# EAGLE design MOD-LCD3310 (EAGLE 6.4)
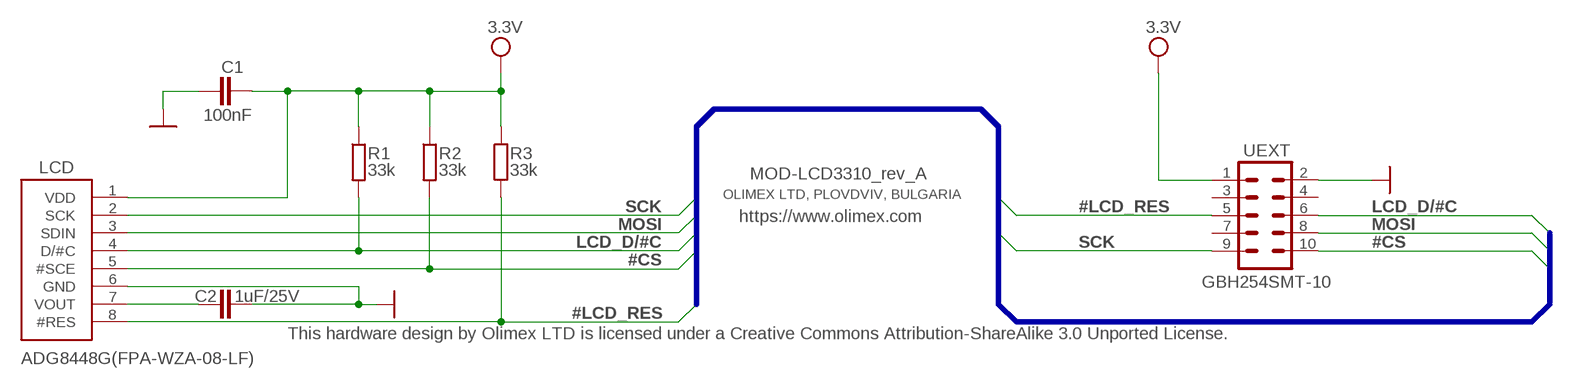
[diagram p0: schematic, sheet 1]

## Parts
C1  100nF  C-EUC0603_DWS  [C0603_DWS]
C2  1uF/25V  C-EUC0805_5MIL_DWS  [C0805_5MIL_DWS]
LCD  ADG8448G(FPA-WZA-08-LF)  NOKIA_3310_LCD-ADG8448G(FPA-WZA-08-LF)  [NOKIA_3310_LCD_CON8_EXACTLY_BOT]
R1  33k  R-EU_R0603_5MIL_DWS  [R0603_5MIL_DWS]
R2  33k  R-EU_R0603_5MIL_DWS  [R0603_5MIL_DWS]
R3  33k  R-EU_R0603_5MIL_DWS  [R0603_5MIL_DWS]
UEXT  GBH254SMT-10  ML10MD  [ML10_S]

## Nets
#CS: LCD.5(#SCE) R2.2 UEXT.10
#LCD_RES: LCD.8(#RES) R3.2 UEXT.5
GND: C1.2 C2.1 LCD.6(GND) UEXT.2
LCD_D/#C: LCD.4(D/#C) R1.2 UEXT.6
LCD_VOUT: C2.2 LCD.7(VOUT)
MOSI: LCD.3(SDIN) UEXT.8
SCK: LCD.2(SCK) UEXT.9
VCC: C1.1 LCD.1(VDD) R1.1 R2.1 R3.1 UEXT.1 ; supply symbol labelled 3.3V
Unconnected: UEXT.3 UEXT.4 UEXT.7

## Buses
SCK,MOSI,#CS,LCD_D/#C,#LCD_RES

## Notes on the sheet
- MOD-LCD3310_rev_A
- OLIMEX LTD, PLOVDVIV, BULGARIA
- https://www.olimex.com
- This hardware design by Olimex LTD is licensed under a Creative Commons Attribution-ShareAlike 3.0 Unported License.

## Library data of the parts
C1 C2 = rcl:C-EU: CAPACITOR, European symbol
LCD = OLIMEX_IC:NOKIA_3310_LCD
R1-R3 = rcl:R-EU_: RESISTOR, European symbol
UEXT = con-harting-ml:ML10: HARTING

## Board
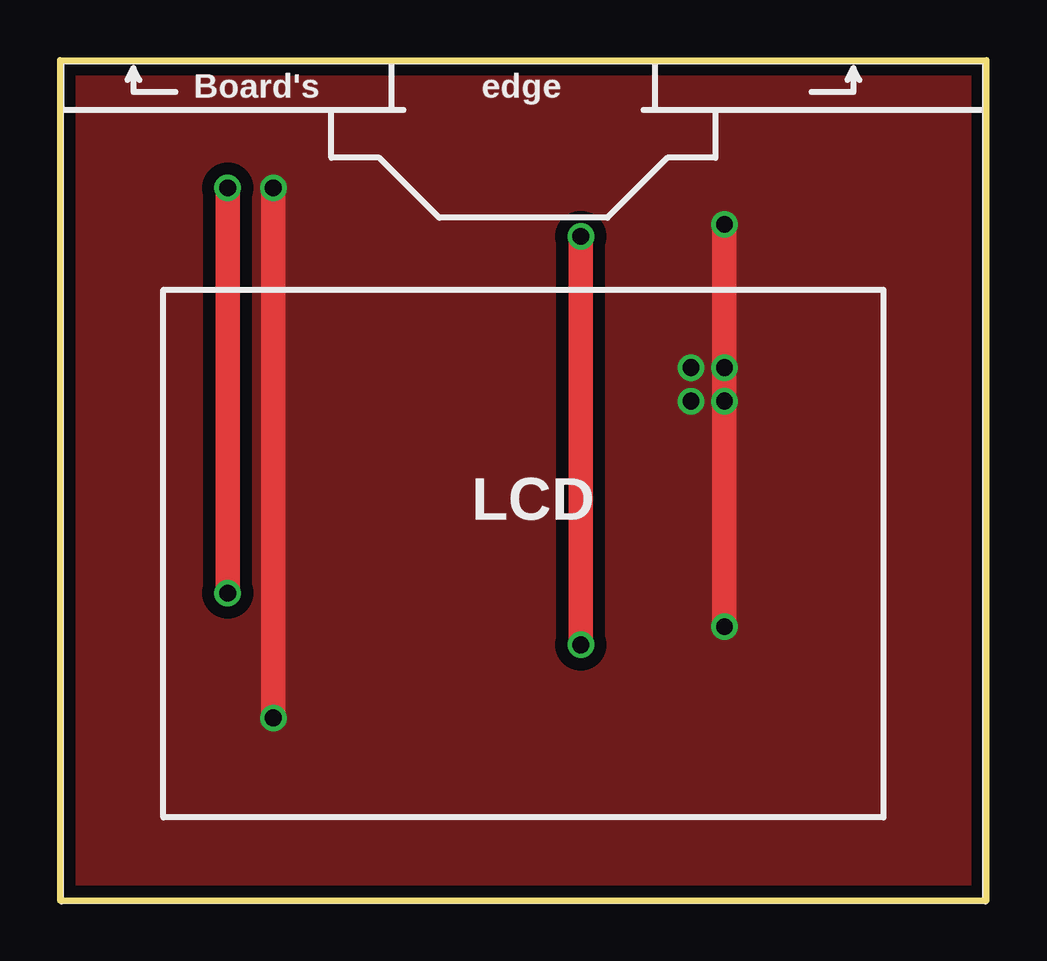
[diagram p1: board, top side]
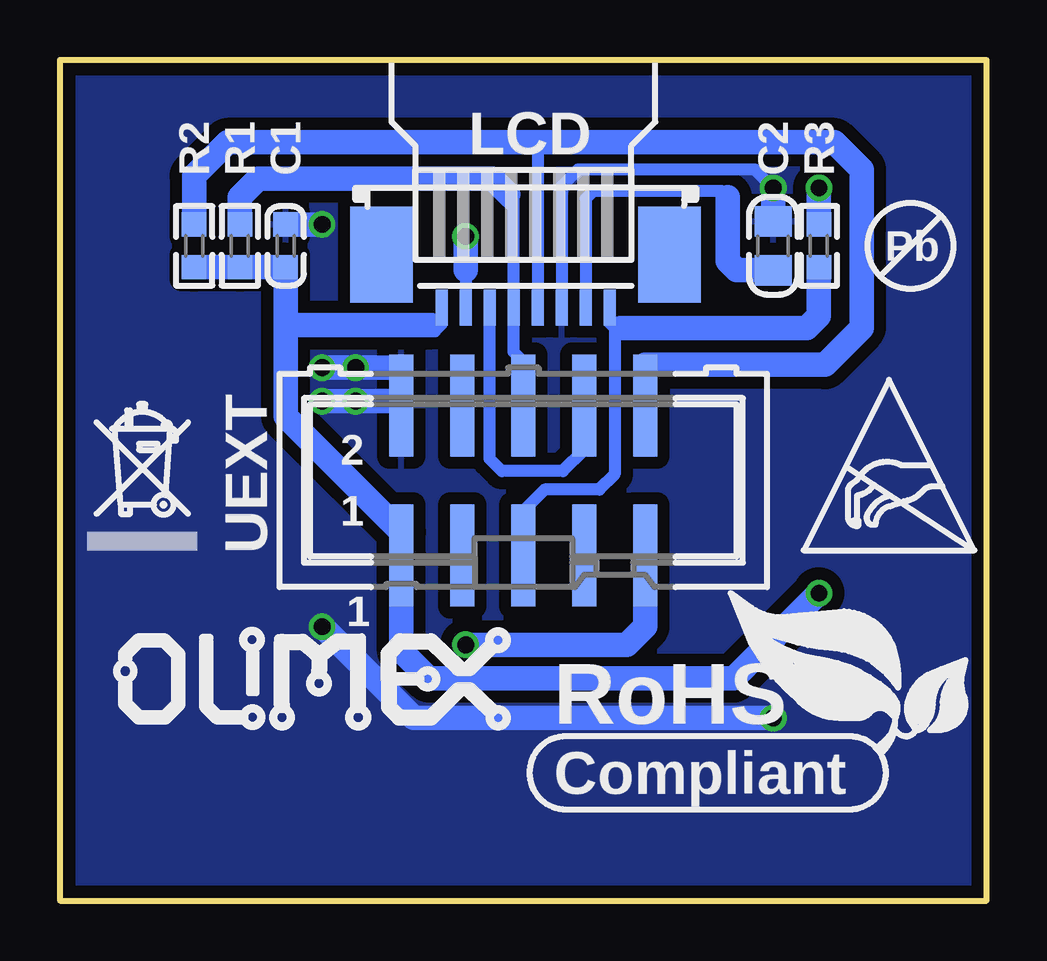
[diagram p2: board, bottom side, seen from below]

Size 38.61 x 35.05 mm. Coordinates in mm from the lower left corner, seen from the top.
Outline: 0,35.05 38.61,35.05 38.61,0 0,0 0,35.05
Copper layers (1+16): Top 0.035mm / dielectric 1.5mm / Bottom 0.035mm
Design rules "default": minimum track width 10mil, minimum drill 23mil, track to track 9.5mil, track to pad 9.5mil, pad to pad 9.5mil, via to via 10mil, smd to smd 1mil, copper to edge 10mil, drill to drill 8mil, minimum pad ring 10mil, minimum via ring 8mil, stop-mask expansion 4mil, vias tented up to drill 28mil, thermal gap 20mil

### Footprints (pad centres in the part's own frame; a part is rotated, then mirrored left to right if it is on the bottom)
C0603_DWS = smd 1.016 x 1.016: 1 -0.889,0; 2 0.889,0
C0805_5MIL_DWS = smd 1.27 x 1.524: 1 -1.016,0; 2 1.016,0
NOKIA_3310_LCD_CON8_EXACTLY_BOT = smd 0.5 x 1.5 bottom: 1 3.4,10.25; 2 2.4,10.25; 3 1.4,10.25; 4 0.4,10.25; 5 -0.6,10.25; 6 -1.6,10.25; 7 -2.6,10.25; 8 -3.6,10.25 | smd 2.6 x 4 bottom: NC1 -6.1,12.45; NC2 5.9,12.45
R0603_5MIL_DWS = smd 1.016 x 1.016: 1 -0.889,0; 2 0.889,0
ML10_S = smd 1 x 4.25: 1 -5.08,-3.125; 2 -5.08,3.125; 3 -2.54,-3.125; 4 -2.54,3.125; 5 0,-3.125; 6 0,3.125; 7 2.54,-3.125; 8 2.54,3.125; 9 5.08,-3.125; 10 5.08,3.125

### Placement (x,y rotation side)
C1  29.21,27.3 90 bottom
C2  8.89,27.3 270 bottom
LCD  19.3,14.48 0 top
R1  31.11,27.3 90 bottom
R2  33.02,27.3 90 bottom
R3  6.99,27.3 270 bottom
U$1  [PB_SMALL]  3.17,27.3 0 bottom
U$2  [RECYCLE_BIN1/8]  37.47,14.61 0 bottom
U$3  [ESD_SYMBOL]  7.62,14.61 0 bottom
U$4  [ROHS]  18.03,4.45 0 bottom
U$8  [OLIMEX1_V]  18.67,6.99 0 bottom
UEXT  19.3,17.53 0 bottom

### Tracks (layer width: path | path; a pad name or v marks a point on that pad's centre or on a via)
#CS
  Bottom 0.508: 18.7,31.62 LCD.5
  Bottom 1.016: UEXT.10 14.22,22.35 6.73,22.35 5.21,23.88 5.21,30.48 6.35,31.62 18.7,31.62 31.62,31.62 33.02,30.23 R2.2
#LCD_RES
  Bottom 0.508: UEXT.5 19.3,16.26 18.41,17.14 16.13,17.14 15.49,17.78 15.49,23.88 | 15.49,23.88 15.7,24.09 LCD.8 | 15.24,23.88 15.49,23.88
  Bottom 1.016: R3.2 6.99,24.38 7.49,23.88 14.81,23.88 15.24,23.88
GND  (via drill 0.7)
  Top 1.016: v27.69,28.19 v27.69,22.23 v27.69,11.43 | v8.89,7.62 v8.89,29.72
  Bottom 0.508: LCD.6 17.7,29.79 17.02,30.48 9.65,30.48 v8.89,29.72
  Bottom 1.016: v8.89,29.72 C2.1 | v27.69,28.19 C1.2 | 24.38,20.83 24.38,22.23 v27.69,22.23 | 24.38,20.83 UEXT.2 | v8.89,7.62 23.88,7.62 v27.69,11.43 | v27.69,20.83 24.38,20.83
  other vias: 26.29,20.83 26.29,22.23
  pour Bottom (isolate 0.508): -5.08,36.83 40.64,36.83 40.64,-2.54 -5.08,-2.54
  pour Top (isolate 0.508): -2.54,35.56 39.37,35.56 39.37,-1.27 -2.54,-1.27
LCD_D/#C
  Bottom 0.508: UEXT.6 19.3,22.48 19.7,22.88 LCD.4 19.7,28.87 | 19.7,28.87 19.7,29.23 19.94,29.46 | 19.7,28.87 20.19,29.36
  Bottom 1.016: 19.94,29.46 20.57,30.1 30.35,30.1 31.11,29.34 R1.2
LCD_VOUT
  Bottom 0.508: LCD.7 16.7,29.27 16.38,29.59 11.05,29.59 10.79,29.34
  Bottom 1.016: 10.79,29.34 10.79,26.67 10.41,26.29 C2.2
MOSI
  Bottom 0.508: LCD.3 20.7,18.42 20.19,17.91 17.65,17.91 16.76,18.8 UEXT.8
SCK  (via drill 0.7)
  Top 1.016: v21.7,10.67 v21.7,27.7
  Bottom 0.508: 21.7,26.29 LCD.2 | UEXT.9 14.22,14.35
  Bottom 1.016: v21.7,27.7 21.7,26.29 | v21.7,10.67 14.99,10.67 14.22,11.43 UEXT.9
VCC  (via drill 0.7)
  Top 1.016: v6.99,12.83 v6.99,29.72
  Bottom 0.508: 23.11,24 23.11,23.75 22.99,23.75 22.7,24.03 LCD.1
  Bottom 1.016: 29.21,24 23.11,24 | 29.21,24 C1.1 R1.1 R2.1 | 29.21,24 29.21,20.19 24.38,15.37 UEXT.1 24.38,10.41 23.24,9.27 10.54,9.27 v6.99,12.83 | v6.99,29.72 R3.1

### Text on the board
bNames: 1
tStop: (C) 2011 | MOD-LCD3310 Rev.A | WWW.OLIMEX.COM/DEV
bStop: WWW.OLIMEX.COM/DEV | (C) 2011 | MOD-LCD3310 Rev.A